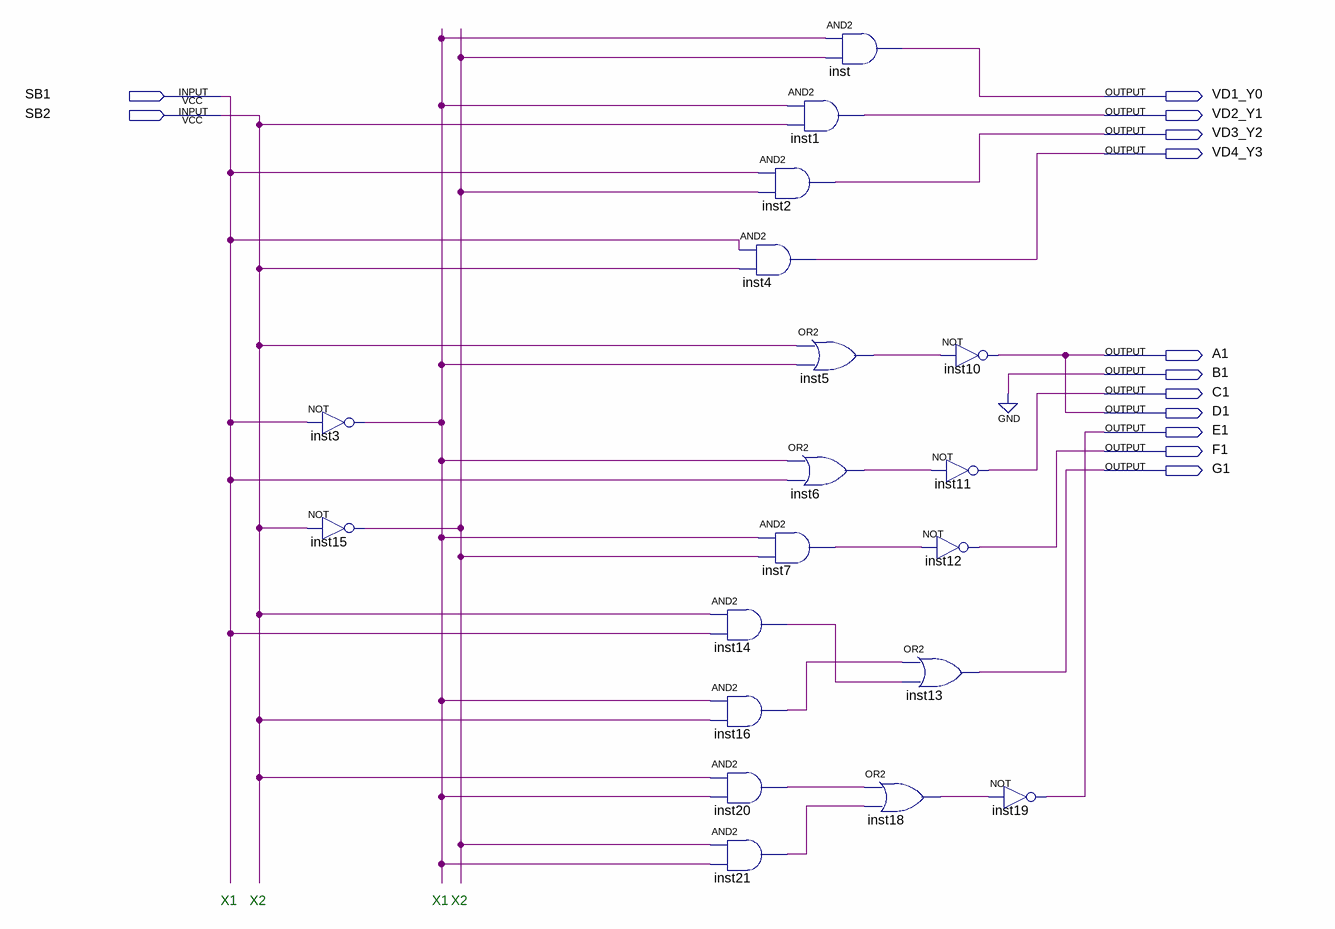
[diagram p0: schematic sheet]
// Quartus schematic lab5.bdf as structural Verilog: 19 symbols, 13 pins
module lab5 (
  input  SB1,
  input  SB2,
  output VD1_Y0,
  output VD2_Y1,
  output VD3_Y2,
  output VD4_Y3,
  output A1,
  output B1,
  output C1,
  output D1,
  output E1,
  output F1,
  output G1
);

  wire inst3_out, inst5_out, inst6_out, inst7_out, inst14_out, inst15_out, inst16_out, inst18_out,
       inst20_out, inst21_out;

  not inst3 (inst3_out, SB1);
  not inst15 (inst15_out, SB2);
  and inst4 (VD4_Y3, SB1, SB2);
  and inst14 (inst14_out, SB2, SB1);
  and inst16 (inst16_out, inst3_out, SB2);
  and inst20 (inst20_out, SB2, inst3_out);
  and inst21 (inst21_out, inst15_out, inst3_out);
  and inst (VD1_Y0, inst3_out, inst15_out);
  and inst1 (VD2_Y1, inst3_out, SB2);
  and inst2 (VD3_Y2, SB1, inst15_out);
  or inst5 (inst5_out, SB2, inst3_out);
  or inst6 (inst6_out, inst3_out, SB1);
  and inst7 (inst7_out, inst3_out, inst15_out);
  or inst13 (G1, inst16_out, inst14_out);
  or inst18 (inst18_out, inst20_out, inst21_out);
  not inst10 (A1, inst5_out);
  not inst11 (C1, inst6_out);
  not inst12 (F1, inst7_out);
  not inst19 (E1, inst18_out);

  assign B1 = 1'b0;
  assign D1 = A1;

  // Notes on the sheet:
  //   X1
  //   X2
  //   X1
  //   X2
endmodule
